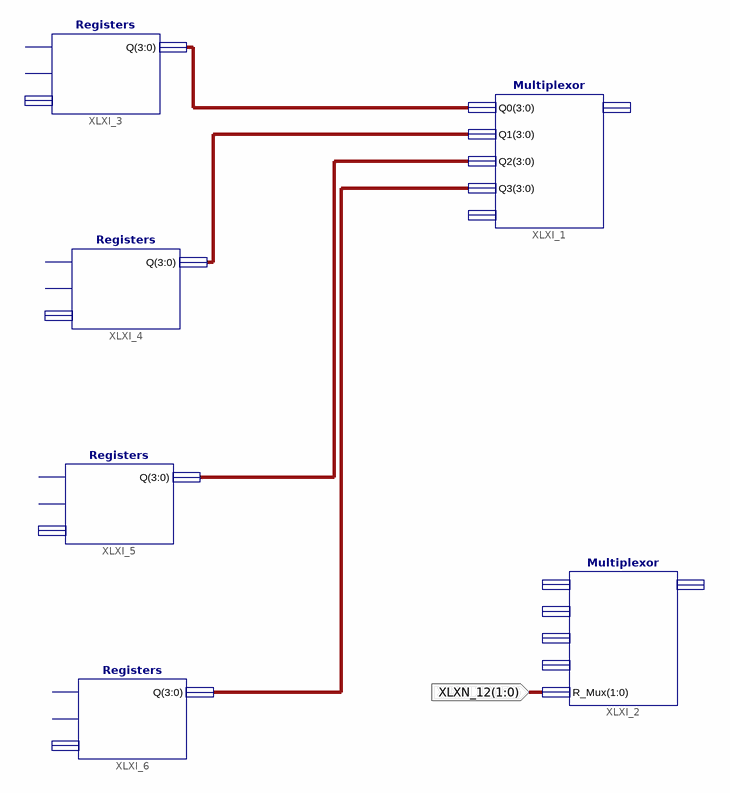
[diagram p0: schematic sheet 1]
// Xilinx ISE schematic Rf.sch (virtex5) as structural Verilog: 6 symbols, 1 ports
module Rf (
  input  [1:0] XLXN_12
);

  wire [3:0] XLXN_1, XLXN_2, XLXN_8, XLXN_10;

  Multiplexor XLXI_1 (.Q0(XLXN_1), .Q1(XLXN_2), .Q2(XLXN_8), .Q3(XLXN_10));  // open: R_Mux, Cr
  Multiplexor XLXI_2 (.R_Mux(XLXN_12));  // open: Q0, Q1, Q2, Q3, Cr
  Registers XLXI_3 (.Q(XLXN_1));  // open: Out_Dec_R, Clk, Dw_Reg
  Registers XLXI_4 (.Q(XLXN_2));  // open: Out_Dec_R, Clk, Dw_Reg
  Registers XLXI_5 (.Q(XLXN_8));  // open: Out_Dec_R, Clk, Dw_Reg
  Registers XLXI_6 (.Q(XLXN_10));  // open: Out_Dec_R, Clk, Dw_Reg
endmodule
